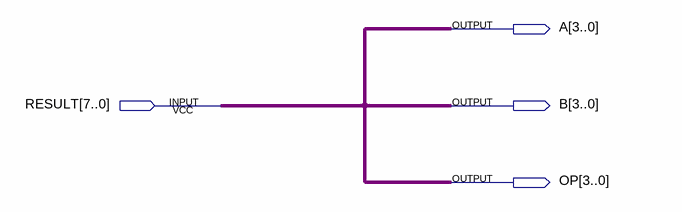
[diagram p0: schematic sheet]
// Quartus schematic BitHexSplit.bdf as structural Verilog: 0 symbols, 4 pins
module BitHexSplit (
  input  [7:0] RESULT,
  output [3:0] A,
  output [3:0] B,
  output [3:0] OP
);


  assign B = A;
  assign OP = A;
endmodule
